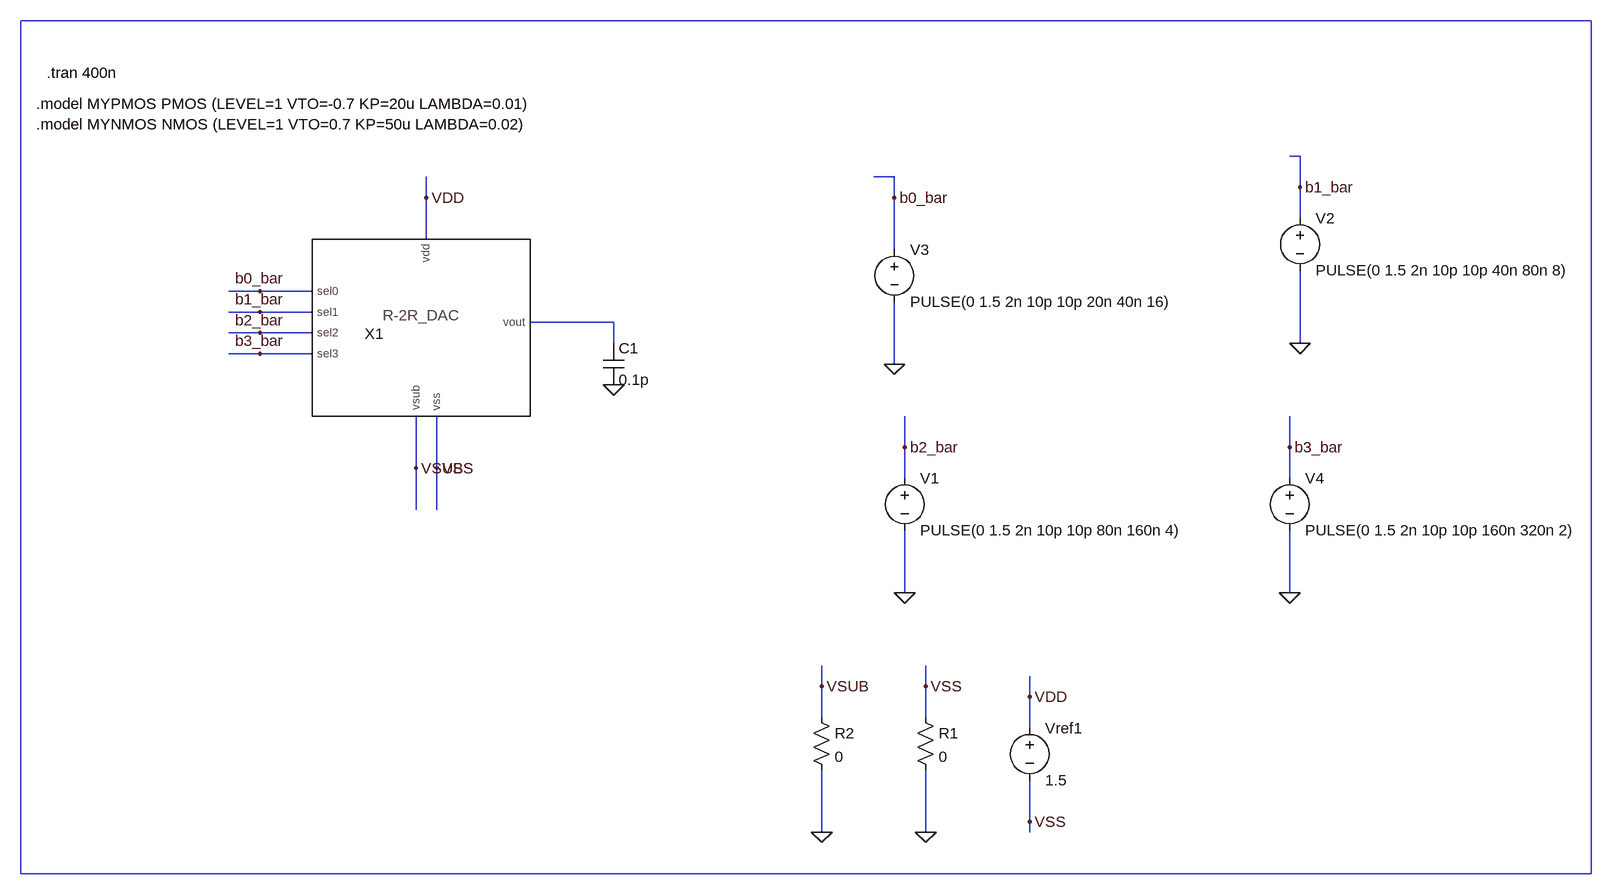
[diagram p0: schematic dsproj_r2rdac_tb.asc]
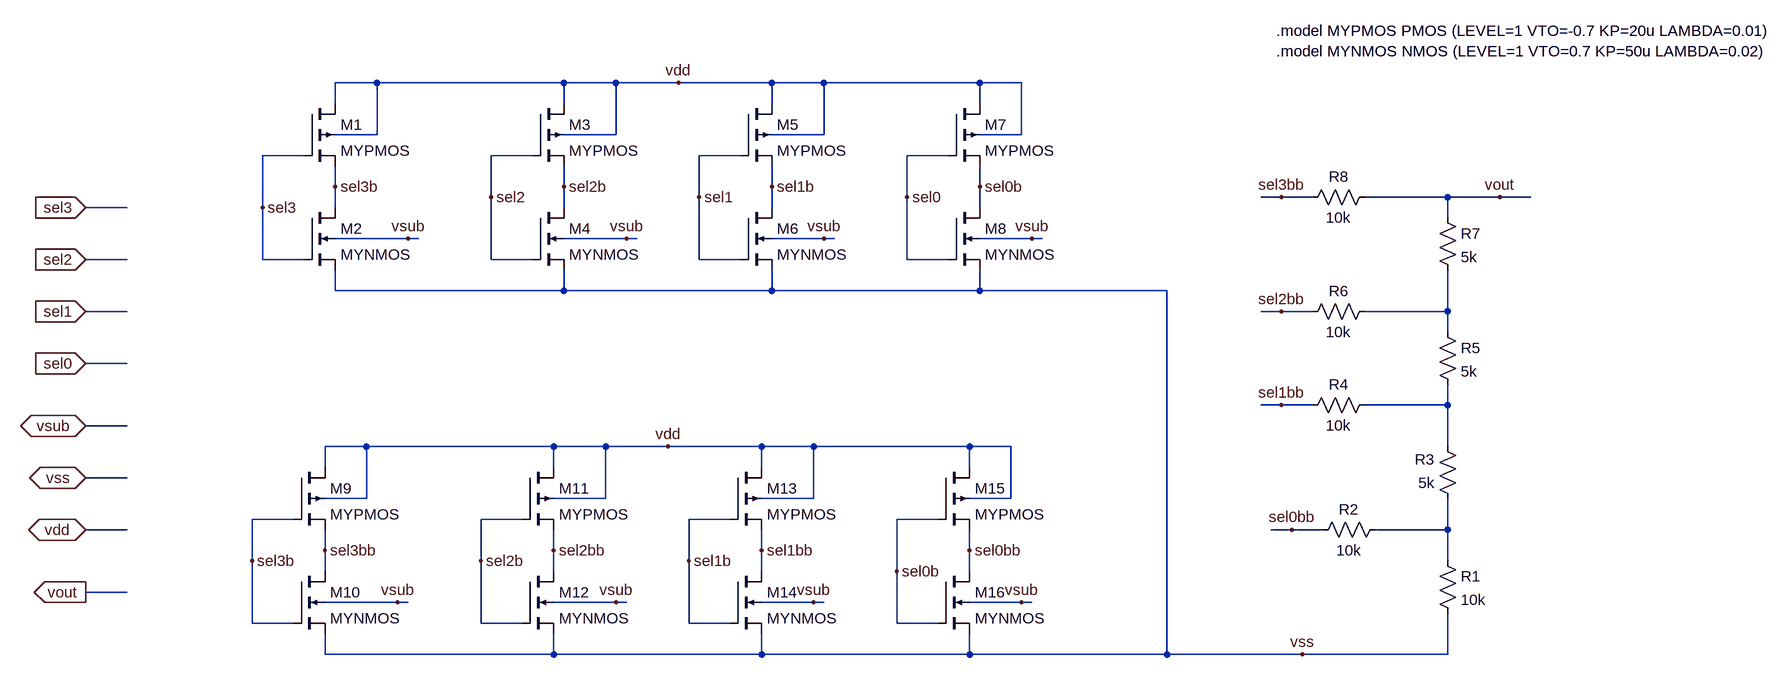
[diagram p1: sub-circuit dsproj_r2rdac.asc]
dsproj_r2rdac_tb.asc, the LTspice schematic file:
Version 4.1
SHEET 1 1652 868
WIRE 352 -240 336 -240
WIRE -272 -208 -304 -208
WIRE 352 -192 352 -240
WIRE -992 -176 -992 -208
WIRE -272 -176 -272 -208
WIRE 352 -144 352 -192
WIRE -992 -112 -992 -176
WIRE -272 -96 -272 -176
WIRE -1248 -32 -1296 -32
WIRE -1168 -32 -1248 -32
WIRE -1248 0 -1296 0
WIRE -1168 0 -1248 0
WIRE -704 16 -832 16
WIRE -1248 32 -1296 32
WIRE -1168 32 -1248 32
WIRE -704 48 -704 16
WIRE 352 48 352 -64
WIRE -1248 64 -1296 64
WIRE -1168 64 -1248 64
WIRE -272 80 -272 -16
WIRE -256 208 -256 160
WIRE 336 208 336 160
WIRE -1008 240 -1008 160
WIRE -976 240 -976 160
WIRE -256 256 -256 208
WIRE 336 256 336 208
WIRE -1008 304 -1008 240
WIRE -976 304 -976 240
WIRE -256 432 -256 336
WIRE 336 432 336 336
WIRE -384 576 -384 544
WIRE -224 576 -224 544
WIRE -64 592 -64 560
WIRE -384 624 -384 576
WIRE -224 624 -224 576
WIRE -64 640 -64 592
WIRE -64 784 -64 720
WIRE -384 800 -384 704
WIRE -224 800 -224 704
WIRE -64 800 -64 784
FLAG -256 432 0
FLAG 352 48 0
FLAG -272 80 0
FLAG -256 208 b2_bar
FLAG 352 -192 b1_bar
FLAG -272 -176 b0_bar
FLAG 336 432 0
FLAG 336 208 b3_bar
FLAG -64 784 VSS
FLAG -64 592 VDD
FLAG -224 576 VSS
FLAG -224 800 0
FLAG -992 -176 VDD
FLAG -976 240 VSS
FLAG -384 576 VSUB
FLAG -384 800 0
FLAG -1008 240 VSUB
FLAG -1248 -32 b0_bar
FLAG -1248 0 b1_bar
FLAG -1248 32 b2_bar
FLAG -1248 64 b3_bar
FLAG -704 112 0
SYMBOL voltage -256 240 R0
WINDOW 123 0 0 Left 0
WINDOW 39 0 0 Left 0
SYMATTR InstName V1
SYMATTR Value PULSE(0 1.5 2n 10p 10p 80n 160n 4)
SYMBOL voltage 352 -160 R0
WINDOW 123 0 0 Left 0
WINDOW 39 0 0 Left 0
SYMATTR InstName V2
SYMATTR Value PULSE(0 1.5 2n 10p 10p 40n 80n 8)
SYMBOL voltage -272 -112 R0
WINDOW 123 0 0 Left 0
WINDOW 39 0 0 Left 0
SYMATTR InstName V3
SYMATTR Value PULSE(0 1.5 2n 10p 10p 20n 40n 16)
SYMBOL voltage 336 240 R0
WINDOW 123 0 0 Left 0
WINDOW 39 0 0 Left 0
SYMATTR InstName V4
SYMATTR Value PULSE(0 1.5 2n 10p 10p 160n 320n 2)
SYMBOL dsproj_r2rdac -1072 96 R0
WINDOW 0 0 -47 Bottom 2
SYMATTR InstName X1
SYMBOL voltage -64 624 R0
WINDOW 123 0 0 Left 0
WINDOW 39 0 0 Left 0
SYMATTR InstName Vref1
SYMATTR Value 1.5
SYMBOL res -240 608 R0
SYMATTR InstName R1
SYMATTR Value 0
SYMBOL res -400 608 R0
SYMATTR InstName R2
SYMATTR Value 0
SYMBOL cap -720 48 R0
SYMATTR InstName C1
SYMATTR Value 0.1p
TEXT -1576 -368 Left 2 !.tran 400n
TEXT -1592 -320 Left 2 !.model MYPMOS PMOS (LEVEL=1 VTO=-0.7 KP=20u LAMBDA=0.01)\n.model MYNMOS NMOS (LEVEL=1 VTO=0.7 KP=50u LAMBDA=0.02)
RECTANGLE Normal 800 864 -1616 -448

dsproj_r2rdac.asc, the sub-circuit schematic file:
Version 4.1
SHEET 1 2032 964
WIRE -144 -128 -208 -128
WIRE 144 -128 -144 -128
WIRE 224 -128 144 -128
WIRE 320 -128 224 -128
WIRE 464 -128 320 -128
WIRE 544 -128 464 -128
WIRE 784 -128 544 -128
WIRE 848 -128 784 -128
WIRE -208 -96 -208 -128
WIRE 144 -96 144 -128
WIRE 464 -96 464 -128
WIRE 784 -96 784 -128
WIRE -144 -48 -144 -128
WIRE -144 -48 -208 -48
WIRE 224 -48 224 -128
WIRE 224 -48 144 -48
WIRE 544 -48 544 -128
WIRE 544 -48 464 -48
WIRE 848 -48 848 -128
WIRE 848 -48 784 -48
WIRE -256 -16 -320 -16
WIRE 96 -16 32 -16
WIRE 416 -16 352 -16
WIRE 736 -16 672 -16
WIRE -208 32 -208 0
WIRE 144 32 144 0
WIRE 464 32 464 0
WIRE 784 32 784 0
WIRE 32 48 32 -16
WIRE 352 48 352 -16
WIRE 672 48 672 -16
WIRE 1248 48 1216 48
WIRE 1296 48 1248 48
WIRE 1504 48 1376 48
WIRE 1584 48 1504 48
WIRE 1632 48 1584 48
WIRE -528 64 -592 64
WIRE -320 64 -320 -16
WIRE -208 64 -208 32
WIRE 144 64 144 32
WIRE 464 64 464 32
WIRE 784 64 784 32
WIRE 1504 80 1504 48
WIRE -96 112 -208 112
WIRE -80 112 -96 112
WIRE 240 112 144 112
WIRE 256 112 240 112
WIRE 544 112 464 112
WIRE 560 112 544 112
WIRE 864 112 784 112
WIRE 880 112 864 112
WIRE -528 144 -592 144
WIRE -320 144 -320 64
WIRE -256 144 -320 144
WIRE 32 144 32 48
WIRE 96 144 32 144
WIRE 352 144 352 48
WIRE 416 144 352 144
WIRE 672 144 672 48
WIRE 736 144 672 144
WIRE -208 192 -208 160
WIRE 144 192 144 160
WIRE 144 192 -208 192
WIRE 464 192 464 160
WIRE 464 192 144 192
WIRE 784 192 784 160
WIRE 784 192 464 192
WIRE 1072 192 784 192
WIRE -528 224 -592 224
WIRE 1248 224 1216 224
WIRE 1296 224 1248 224
WIRE 1504 224 1504 160
WIRE 1504 224 1376 224
WIRE 1504 256 1504 224
WIRE -528 304 -592 304
WIRE 1248 368 1216 368
WIRE 1296 368 1248 368
WIRE 1504 368 1504 336
WIRE 1504 368 1376 368
WIRE -528 400 -592 400
WIRE -160 432 -224 432
WIRE 128 432 -160 432
WIRE 208 432 128 432
WIRE 304 432 208 432
WIRE 448 432 304 432
WIRE 528 432 448 432
WIRE 768 432 528 432
WIRE 832 432 768 432
WIRE 1504 432 1504 368
WIRE -224 464 -224 432
WIRE 128 464 128 432
WIRE 448 464 448 432
WIRE 768 464 768 432
WIRE -528 480 -592 480
WIRE -160 512 -160 432
WIRE -160 512 -224 512
WIRE 208 512 208 432
WIRE 208 512 128 512
WIRE 528 512 528 432
WIRE 528 512 448 512
WIRE 832 512 832 432
WIRE 832 512 768 512
WIRE -272 544 -336 544
WIRE 80 544 16 544
WIRE 400 544 336 544
WIRE 720 544 656 544
WIRE -528 560 -592 560
WIRE 1264 560 1232 560
WIRE 1312 560 1264 560
WIRE 1504 560 1504 512
WIRE 1504 560 1392 560
WIRE -224 592 -224 560
WIRE 128 592 128 560
WIRE 448 592 448 560
WIRE 768 592 768 560
WIRE -336 608 -336 544
WIRE 16 608 16 544
WIRE 336 608 336 544
WIRE 1504 608 1504 560
WIRE -224 624 -224 592
WIRE 128 624 128 592
WIRE 448 624 448 592
WIRE 656 624 656 544
WIRE 768 624 768 592
WIRE -528 656 -592 656
WIRE -112 672 -224 672
WIRE -96 672 -112 672
WIRE 224 672 128 672
WIRE 240 672 224 672
WIRE 528 672 448 672
WIRE 544 672 528 672
WIRE 848 672 768 672
WIRE 864 672 848 672
WIRE -336 704 -336 608
WIRE -272 704 -336 704
WIRE 16 704 16 608
WIRE 80 704 16 704
WIRE 336 704 336 608
WIRE 400 704 336 704
WIRE 656 704 656 624
WIRE 720 704 656 704
WIRE -224 752 -224 720
WIRE 128 752 128 720
WIRE 128 752 -224 752
WIRE 448 752 448 720
WIRE 448 752 128 752
WIRE 768 752 768 720
WIRE 768 752 448 752
WIRE 1072 752 1072 192
WIRE 1072 752 768 752
WIRE 1280 752 1072 752
WIRE 1504 752 1504 688
WIRE 1504 752 1280 752
FLAG 240 112 vsub
FLAG 544 112 vsub
FLAG 864 112 vsub
FLAG -96 112 vsub
FLAG 320 -128 vdd
FLAG 224 672 vsub
FLAG 528 672 vsub
FLAG 848 672 vsub
FLAG -112 672 vsub
FLAG 304 432 vdd
FLAG 672 48 sel0
FLAG 352 48 sel1
FLAG 32 48 sel2
FLAG -320 64 sel3
FLAG 656 624 sel0b
FLAG 336 608 sel1b
FLAG 16 608 sel2b
FLAG -336 608 sel3b
FLAG -208 32 sel3b
FLAG 144 32 sel2b
FLAG 464 32 sel1b
FLAG 784 32 sel0b
FLAG -224 592 sel3bb
FLAG 128 592 sel2bb
FLAG 448 592 sel1bb
FLAG 768 592 sel0bb
FLAG 1280 752 vss
FLAG 1584 48 vout
FLAG 1264 560 sel0bb
FLAG 1248 368 sel1bb
FLAG 1248 224 sel2bb
FLAG 1248 48 sel3bb
FLAG -592 560 vdd
IOPIN -592 560 BiDir
FLAG -592 480 vss
IOPIN -592 480 BiDir
FLAG -592 400 vsub
IOPIN -592 400 BiDir
FLAG -592 304 sel0
IOPIN -592 304 In
FLAG -592 224 sel1
IOPIN -592 224 In
FLAG -592 144 sel2
IOPIN -592 144 In
FLAG -592 64 sel3
IOPIN -592 64 In
FLAG -592 656 vout
IOPIN -592 656 Out
SYMBOL pmos4 -256 -96 R0
SYMATTR InstName M1
SYMATTR Value MYPMOS
SYMATTR Value2 l=180e-9 w=2.4e-6
SYMBOL nmos4 -256 64 R0
SYMATTR InstName M2
SYMATTR Value MYNMOS
SYMATTR Value2 l=180e-9 w=1.2e-6
SYMBOL pmos4 96 -96 R0
SYMATTR InstName M3
SYMATTR Value MYPMOS
SYMATTR Value2 l=180e-9 w=2.4e-6 m=1
SYMBOL nmos4 96 64 R0
SYMATTR InstName M4
SYMATTR Value MYNMOS
SYMATTR Value2 l=180e-9 w=1.2e-6 m=1
SYMBOL pmos4 416 -96 R0
SYMATTR InstName M5
SYMATTR Value MYPMOS
SYMATTR Value2 l=180e-9 w=2.4e-6 m=1
SYMBOL nmos4 416 64 R0
SYMATTR InstName M6
SYMATTR Value MYNMOS
SYMATTR Value2 l=180e-9 w=1.2e-6 m=1
SYMBOL pmos4 736 -96 R0
SYMATTR InstName M7
SYMATTR Value MYPMOS
SYMATTR Value2 l=180e-9 w=2.4e-6 m=1
SYMBOL nmos4 736 64 R0
SYMATTR InstName M8
SYMATTR Value MYNMOS
SYMATTR Value2 l=180e-9 w=1.2e-6 m=1
SYMBOL pmos4 -272 464 R0
SYMATTR InstName M9
SYMATTR Value MYPMOS
SYMATTR Value2 l=180e-9 w=2.4e-6 m=1
SYMBOL nmos4 -272 624 R0
SYMATTR InstName M10
SYMATTR Value MYNMOS
SYMATTR Value2 l=180e-9 w=1.2e-6 m=1
SYMBOL pmos4 80 464 R0
SYMATTR InstName M11
SYMATTR Value MYPMOS
SYMATTR Value2 l=180e-9 w=2.4e-6 m=1
SYMBOL nmos4 80 624 R0
SYMATTR InstName M12
SYMATTR Value MYNMOS
SYMATTR Value2 l=180e-9 w=1.2e-6 m=1
SYMBOL pmos4 400 464 R0
SYMATTR InstName M13
SYMATTR Value MYPMOS
SYMATTR Value2 l=180e-9 w=2.4e-6 m=1
SYMBOL nmos4 400 624 R0
SYMATTR InstName M14
SYMATTR Value MYNMOS
SYMATTR Value2 l=180e-9 w=1.2e-6 m=1
SYMBOL pmos4 720 464 R0
SYMATTR InstName M15
SYMATTR Value MYPMOS
SYMATTR Value2 l=180e-9 w=2.4e-6 m=1
SYMBOL nmos4 720 624 R0
SYMATTR InstName M16
SYMATTR Value MYNMOS
SYMATTR Value2 l=180e-9 w=1.2e-6 m=1
SYMBOL res 1488 592 R0
SYMATTR InstName R1
SYMATTR Value 10k
SYMBOL res 1408 544 R90
WINDOW 0 0 56 VBottom 2
WINDOW 3 32 56 VTop 2
SYMATTR InstName R2
SYMATTR Value 10k
SYMBOL res 1520 528 R180
WINDOW 0 36 76 Left 2
WINDOW 3 36 40 Left 2
SYMATTR InstName R3
SYMATTR Value 5k
SYMBOL res 1280 384 R270
WINDOW 0 32 56 VTop 2
WINDOW 3 0 56 VBottom 2
SYMATTR InstName R4
SYMATTR Value 10k
SYMBOL res 1488 240 R0
SYMATTR InstName R5
SYMATTR Value 5k
SYMBOL res 1392 208 R90
WINDOW 0 0 56 VBottom 2
WINDOW 3 32 56 VTop 2
SYMATTR InstName R6
SYMATTR Value 10k
SYMBOL res 1488 64 R0
SYMATTR InstName R7
SYMATTR Value 5k
SYMBOL res 1392 32 R90
WINDOW 0 0 56 VBottom 2
WINDOW 3 32 56 VTop 2
SYMATTR InstName R8
SYMATTR Value 10k
TEXT 1240 -208 Left 2 !.model MYPMOS PMOS (LEVEL=1 VTO=-0.7 KP=20u LAMBDA=0.01)\n.model MYNMOS NMOS (LEVEL=1 VTO=0.7 KP=50u LAMBDA=0.02)

The netlist it stands for:
* dsproj_r2rdac_tb.asc
V1 b2_bar 0 PULSE(0 1.5 2n 10p 10p 80n 160n 4)
V2 b1_bar 0 PULSE(0 1.5 2n 10p 10p 40n 80n 8)
V3 b0_bar 0 PULSE(0 1.5 2n 10p 10p 20n 40n 16)
V4 b3_bar 0 PULSE(0 1.5 2n 10p 10p 160n 320n 2)
X§X1 b0_bar b1_bar b2_bar b3_bar VDD N001 VSS VSUB dsproj_r2rdac
Vref1 VDD VSS 1.5
R1 VSS 0 0
R2 VSUB 0 0
C1 N001 0 0.1p

* block symbol definitions
.subckt dsproj_r2rdac sel0 sel1 sel2 sel3 vdd vout vss vsub
M1 vdd sel3 sel3b vdd MYPMOS l=180e-9 w=2.4e-6
M2 sel3b sel3 vss vsub MYNMOS l=180e-9 w=1.2e-6
M3 vdd sel2 sel2b vdd MYPMOS l=180e-9 w=2.4e-6 m=1
M4 sel2b sel2 vss vsub MYNMOS l=180e-9 w=1.2e-6 m=1
M5 vdd sel1 sel1b vdd MYPMOS l=180e-9 w=2.4e-6 m=1
M6 sel1b sel1 vss vsub MYNMOS l=180e-9 w=1.2e-6 m=1
M7 vdd sel0 sel0b vdd MYPMOS l=180e-9 w=2.4e-6 m=1
M8 sel0b sel0 vss vsub MYNMOS l=180e-9 w=1.2e-6 m=1
M9 vdd sel3b sel3bb vdd MYPMOS l=180e-9 w=2.4e-6 m=1
M10 sel3bb sel3b vss vsub MYNMOS l=180e-9 w=1.2e-6 m=1
M11 vdd sel2b sel2bb vdd MYPMOS l=180e-9 w=2.4e-6 m=1
M12 sel2bb sel2b vss vsub MYNMOS l=180e-9 w=1.2e-6 m=1
M13 vdd sel1b sel1bb vdd MYPMOS l=180e-9 w=2.4e-6 m=1
M14 sel1bb sel1b vss vsub MYNMOS l=180e-9 w=1.2e-6 m=1
M15 vdd sel0b sel0bb vdd MYPMOS l=180e-9 w=2.4e-6 m=1
M16 sel0bb sel0b vss vsub MYNMOS l=180e-9 w=1.2e-6 m=1
R1 N003 vss 10k
R2 N003 sel0bb 10k
R3 N003 N002 5k
R4 sel1bb N002 10k
R5 N001 N002 5k
R6 N001 sel2bb 10k
R7 vout N001 5k
R8 vout sel3bb 10k
.model MYPMOS PMOS (LEVEL=1 VTO=-0.7 KP=20u LAMBDA=0.01)
.model MYNMOS NMOS (LEVEL=1 VTO=0.7 KP=50u LAMBDA=0.02)
.ends dsproj_r2rdac

.model NMOS NMOS
.model PMOS PMOS
.lib standard.mos
.tran 400n
.model MYPMOS PMOS (LEVEL=1 VTO=-0.7 KP=20u LAMBDA=0.01)
.model MYNMOS NMOS (LEVEL=1 VTO=0.7 KP=50u LAMBDA=0.02)
.backanno
.end